# Altium schematic sheet 1_Power.SchDoc
size A4
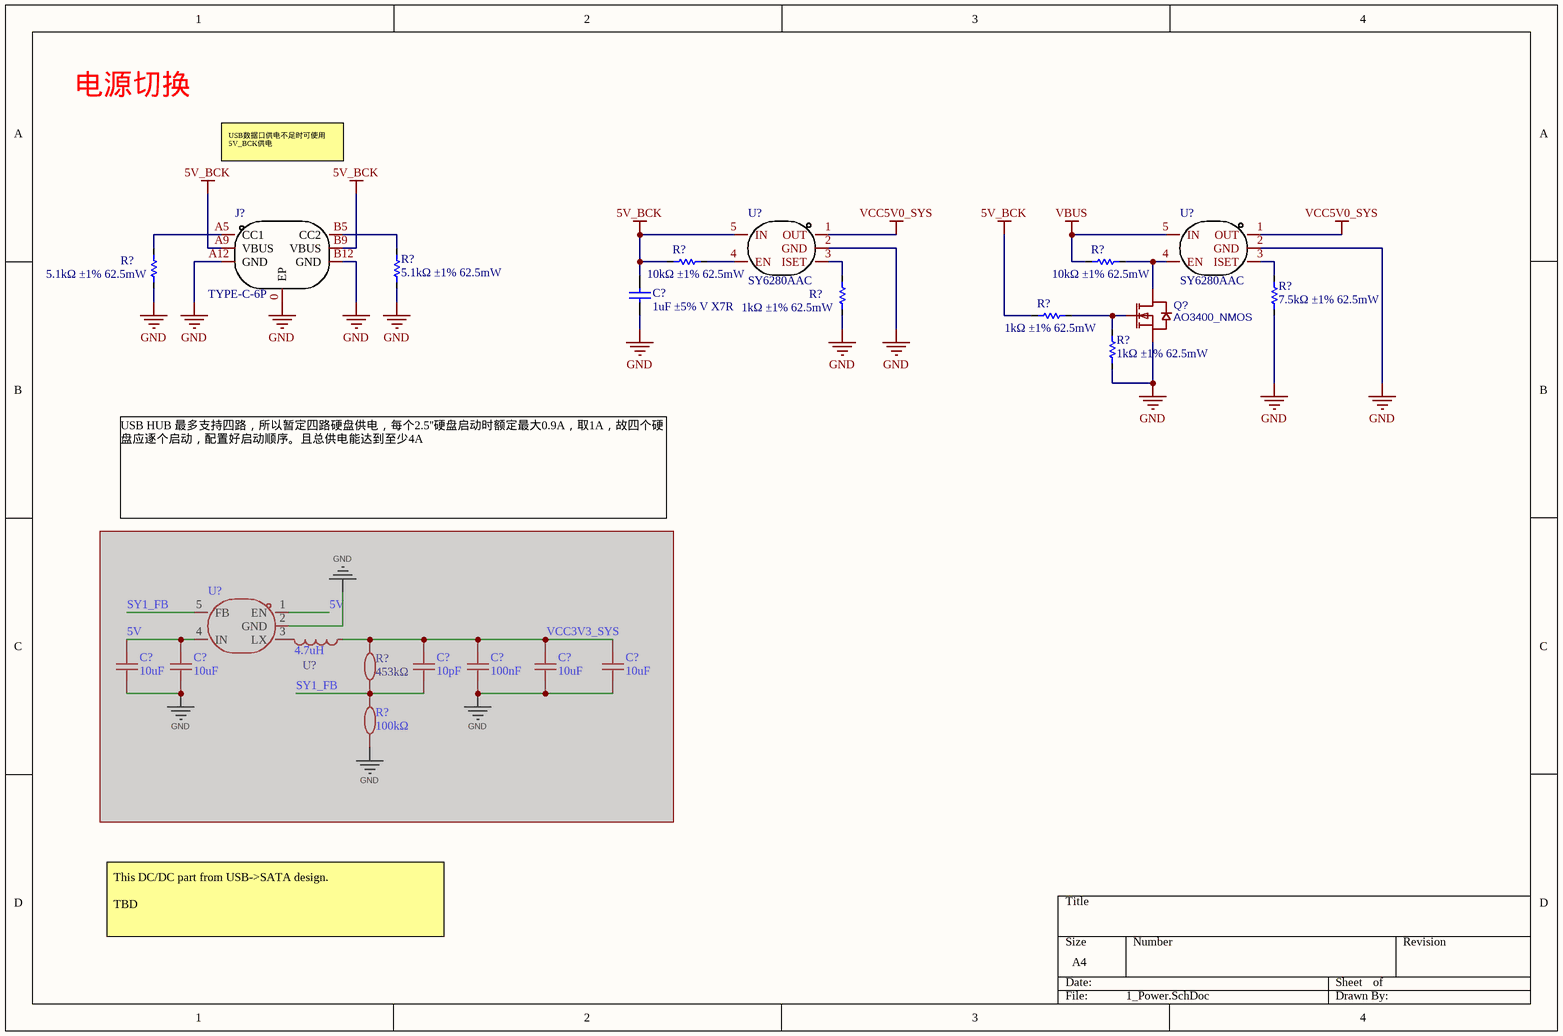
[diagram p0: 1_Power.SchDoc]

## Parts
(Parts that share a designator on the sheet are numbered #1, #2 ... from top to bottom, then left to right.)
C?#1  1uF ±5% V X7R  [C0402]
C?#2  10uF  [C0603]  (masked out: inside a compile mask, not in the netlist)
C?#3  10uF  [C0603]  (masked out: inside a compile mask, not in the netlist)
C?#4  10pF  [C0402]  (masked out: inside a compile mask, not in the netlist)
C?#5  100nF  [C0402]  (masked out: inside a compile mask, not in the netlist)
C?#6  10uF  [C0603]  (masked out: inside a compile mask, not in the netlist)
C?#7  10uF  [C0603]  (masked out: inside a compile mask, not in the netlist)
J?  TYPE-C-6P  [TYPE-C-6P]
Q?  AO3400_NMOS  [SOT-23-3_L2.9-W1.3-P1.90-LS2.4-BR]
R?#1  10kΩ ±1% 62.5mW  [R0402]
R?#2  10kΩ ±1% 62.5mW  [R0402]
R?#3  5.1kΩ ±1% 62.5mW  [R0402]
R?#4  5.1kΩ ±1% 62.5mW  [R0402]
R?#5  1kΩ ±1% 62.5mW  [R0402]
R?#6  7.5kΩ ±1% 62.5mW  [R0402]
R?#7  1kΩ ±1% 62.5mW  [R0402]
R?#8  1kΩ ±1% 62.5mW  [R0402]
R?#9  453kΩ  [R0402]  (masked out: inside a compile mask, not in the netlist)
R?#10  100kΩ  [R0402]  (masked out: inside a compile mask, not in the netlist)
U?#1  SY6280AAC  [SOT-23-5_L3.0-W1.7-P0.95-LS2.8-BR]
U?#2  SY6280AAC  [SOT-23-5_L3.0-W1.7-P0.95-LS2.8-BR]
U?#3  SY8089A1AAC  [TSOT-23-5_L2.9-W1.6-P0.95-LS2.8-BR]  (value not drawn)  (masked out: inside a compile mask, not in the netlist)
U?#4  4.7uH  [IND-SMD_L4.0-W4.0]  (masked out: inside a compile mask, not in the netlist)

## Nets
5V_BCK: C?#1.2 J?.A9(VBUS) J?.B9(VBUS) R?#1.2 R?#7.2 U?#1.5(IN)
GND: C?#1.1 J?.0(EP) J?.A12(GND) J?.B12(GND) Q?.2(S) R?#3.1 R?#4.1 R?#5.1 R?#6.2 R?#8.2 U?#1.2(GND) U?#2.2(GND)
VBUS: R?#2.2 U?#2.5(IN)
VCC5V0_SYS: U?#1.1(OUT) U?#2.1(OUT)
NetJ?_A5: J?.A5(CC1) R?#3.2
NetJ?_B5: J?.B5(CC2) R?#4.2
NetQ?_1: Q?.1(G) R?#7.1 R?#8.1
NetQ?_3: Q?.3(D) R?#2.1 U?#2.4(EN)
NetR?#1_1: R?#1.1 U?#1.4(EN)
NetR?#5_2: R?#5.2 U?#1.3(ISET)
NetR?#6_1: R?#6.1 U?#2.3(ISET)

## Notes on the sheet
- 电源切换
- USB数据口供电不足时可使用5V_BCK供电
- USB HUB 最多支持四路，所以暂定四路硬盘供电，每个2.5''硬盘启动时额定最大0.9A，取1A，故四个硬盘应逐个启动，配置好启动顺序。且总供电能达到至少4A
- This DC/DC part from USB->SATA design.
  TBD

## Library data of the parts
C?#1 = C0402: Capacitor; Published: 8-Jun-2000; LatestRevisionDate: 17-Jul-2002; LatestRevisionNote: Re-released for DXP Platform.; PackageReference: RAD-0.3; Publisher: Altium Limited; PackageDescription: Radial Cap, Thru-Hole; 2 Leads; 0.3 in Pin Spacing
C?#2 C?#3 C?#6 C?#7 = CL10A106KP8NNNC: Manufacturer: SAMSUNG(三星); Add into BOM: yes; Tolerance: ±10%; Voltage Rated: 10V; Temperature Coefficient: X5R; Symbol: CL10A106KP8NNNC; Device: CL10A106KP8NNNC; LCSC Part Name: 10uF ±10% 10V; Supplier Part: C19702; Manufacturer Part: CL10A106KP8NNNC; Supplier Footprint: 0603; JLCPCB Part Class: Basic Part; Datasheet: https://atta.szlcsc.com/upload/public/pdf/source/20160103/1457707703378.pdf; Supplier: LCSC; Convert to PCB: yes; Value: 10uF
C?#4 = TCC0402COG100J500AT: Manufacturer: CCTC(三环); Add into BOM: yes; Tolerance: ±5%; Voltage Rated: 50V; Temperature Coefficient: C0G; Symbol: TCC0402COG100J500AT; Device: TCC0402COG100J500AT; LCSC Part Name: 10pF ±5% 50V; Supplier Part: C696913; Manufacturer Part: TCC0402COG100J500AT; Supplier Footprint: 0402; JLCPCB Part Class: Extended Part; Datasheet: https://atta.szlcsc.com/upload/public/pdf/source/20200707/C696841_89A2C111301AB76AE7642008585E7A11.pdf; Supplier: LCSC; Convert to PCB: yes; Value: 10pF
C?#5 = TCC0402X5R104M250AT: Manufacturer: CCTC(三环); Add into BOM: yes; Tolerance: ±20%; Voltage Rated: 25V; Temperature Coefficient: X5R; Symbol: TCC0402X5R104M250AT; Device: TCC0402X5R104M250AT; LCSC Part Name: 100nF ±20% 25V; Supplier Part: C359190; Manufacturer Part: TCC0402X5R104M250AT; Supplier Footprint: 0402; JLCPCB Part Class: Extended Part; Datasheet: https://atta.szlcsc.com/upload/public/pdf/source/20190103/C359190_40860758378AF13613616C0AB9EED028.pdf; Supplier: LCSC; Convert to PCB: yes; Value: 100nF
Q? = AO3400_C841146: BOM_Manufacturer: LGE; BOM_Manufacturer Part: AO3400; Contributor: LCSC; BOM_Supplier: LCSC; BOM_Supplier Part: C841146; BOM_JLCPCB Part Class: Extended Part; spicePre: Q; spiceSymbolName: AO3400_C841146
R?#1-R?#8 = R0402: Resistor; Published: 8-Jun-2000; LatestRevisionDate: 17-Jul-2002; LatestRevisionNote: Re-released for DXP Platform.; PackageReference: AXIAL-0.3; Publisher: Altium Limited; PackageDescription: Axial Device, Thru-Hole; 2 Leads; 0.3 in Pin Spacing
R?#9 = 0402WGF4533TCE: Manufacturer: UNI-ROYAL(厚声); Add into BOM: yes; Tolerance: ±1%; Power(Watts): 62.5mW; Overload Voltage (Max): 50V; Temperature Coefficient: ±100ppm/℃; Symbol: 0402WGF4533TCE; Device: 0402WGF4533TCE; Supplier: LCSC; Manufacturer Part: 0402WGF4533TCE; Value: 453kΩ; Supplier Part: C27009; JLCPCB Part Class: Extended Part; LCSC Part Name: 453kΩ ±1% 62.5mW 厚膜电阻; Supplier Footprint: 0402; Datasheet: https://atta.szlcsc.com/upload/public/pdf/source/20200306/C422600_1E6D84923E4A46A82E41ADD87F860B5C.pdf; Convert to PCB: yes; Type: 厚膜电阻; Operating Temperature Range: -55℃~+155℃
R?#10 = CR0402JF0104G: Manufacturer: LIZ(丽智电子); Add into BOM: yes; Tolerance: ±5%; Power(Watts): 62.5mW; Temperature Coefficient: ±200ppm/; Overload Voltage (Max): 50V; Symbol: CR0402JF0104G; Device: CR0402JF0104G; LCSC Part Name: 100kΩ ±5% 62.5mW; Supplier Part: C100573; Manufacturer Part: CR0402JF0104G; Supplier Footprint: 0402; JLCPCB Part Class: Extended Part; Datasheet: https://atta.szlcsc.com/upload/public/pdf/source/20170408/1491631220702.pdf; Supplier: LCSC; Convert to PCB: yes; Type: 厚膜电阻; Value: 100kΩ; Operating Temperature Range: -55~+125
U?#3 = SY8089A1AAC: Manufacturer: silergy(矽力杰); Add into BOM: yes; Symbol: SY8089A1AAC; Device: SY8089A1AAC; LCSC Part Name: SY8089A1AAC; Supplier Part: C479074; Manufacturer Part: SY8089A1AAC; Supplier Footprint: SOT-23-5; JLCPCB Part Class: 扩展库; Datasheet: https://atta.szlcsc.com/upload/public/pdf/source/20200117/C479074_09E605B8BDE11DB5A08573B7E6429A0D.pdf; Supplier: LCSC; Convert to PCB: yes
U?#4 = SFE4030A-4R7M-F-HF: Manufacturer: DDY(德立); Add into BOM: yes; Tolerance: ±20%; Rated Current: 2.3A; Saturation Current (Isat): 3.2A; DC Resistance (DCR): 67mΩ; Symbol: SFE4030A-4R7M-F-HF; Device: SFE4030A-4R7M-F-HF; LCSC Part Name: 4.7uH ±20% 3.2A; Supplier Part: C5159670; Manufacturer Part: SFE4030A-4R7M-F-HF; Supplier Footprint: SMD,4x4mm; JLCPCB Part Class: 扩展库; Datasheet: https://atta.szlcsc.com/upload/public/pdf/source/20221009/E6A1C7112975AA831F7D1355BB828BA7.pdf; Supplier: LCSC; Convert to PCB: yes; Value: 4.7uH